# Altium schematic sheet 00_ECU V1.0 B - COVER.SchDoc
size A4; Email: eliofagundez07@gmail.com; DrawnBy: Elio F.; Engineer: Elio F.; Revision: A; SheetNumber: 1; SheetTotal: 22; Sheet Title: Cover Page
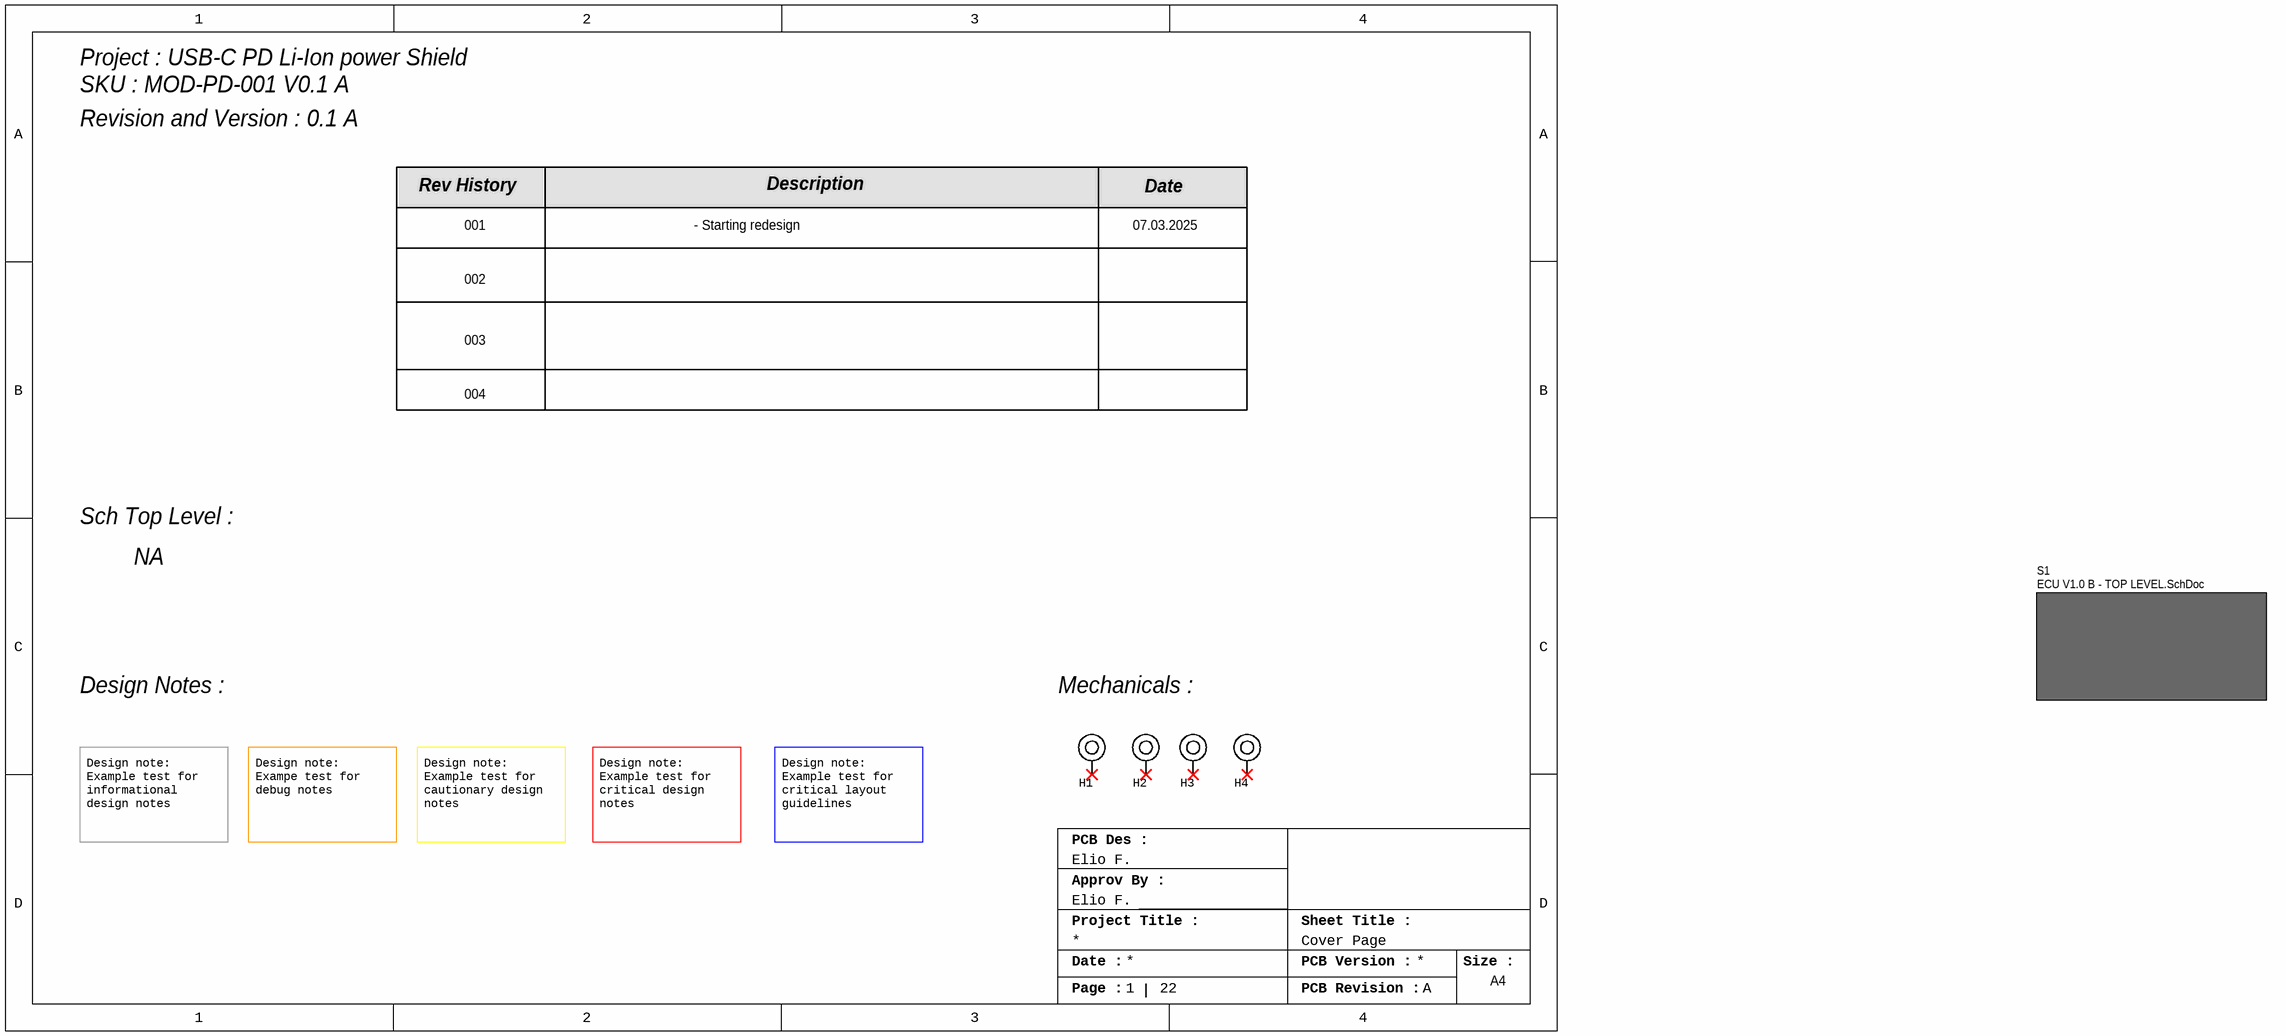
[diagram p0: 00_ECU V1.0 B - COVER.SchDoc]

## Parts
H1  Mounting Hole  [PTH_2.7X6]  (value not drawn)  (no BOM)
H2  Mounting Hole  [PTH_2.7X6]  (value not drawn)  (no BOM)
H3  Mounting Hole  [PTH_2.7X6]  (value not drawn)  (no BOM)
H4  Mounting Hole  [PTH_2.7X6]  (value not drawn)  (no BOM)

## Sub-sheets
S1 = ECU V1.0 B - TOP LEVEL.SchDoc: no entries

## Nets

Not connected (* = marked no-connect by the designer): H1 1*; H2 1*; H3 1*; H4 1*

## Notes on the sheet
- Project : USB-C PD Li-Ion power Shield
- SKU : MOD-PD-001 V0.1 A
- Revision and Version : 0.1 A
- Rev History
- 001
- - Starting redesign
- Description
- 07.03.2025
- Date
- 002
- 003
- 004
- Sch Top Level :
- NA
- Design Notes :
- Mechanicals :
- Design note:
  Example test for informational design notes
- Design note:
  Exampe test for debug notes
- Design note:
  Example test for cautionary design notes
- Design note:
  Example test for critical design notes
- Design note:
  Example test for critical layout guidelines
- PCB Des :
- Approv By :
- Project Title :
- Sheet Title :
- Date :
- PCB Version :
- Size :
- A4
- Page :
- PCB Revision :

## Library data of the parts
H1-H4 = MECHANICALS_MOUNT_PTH: Mounting Hole, Plated